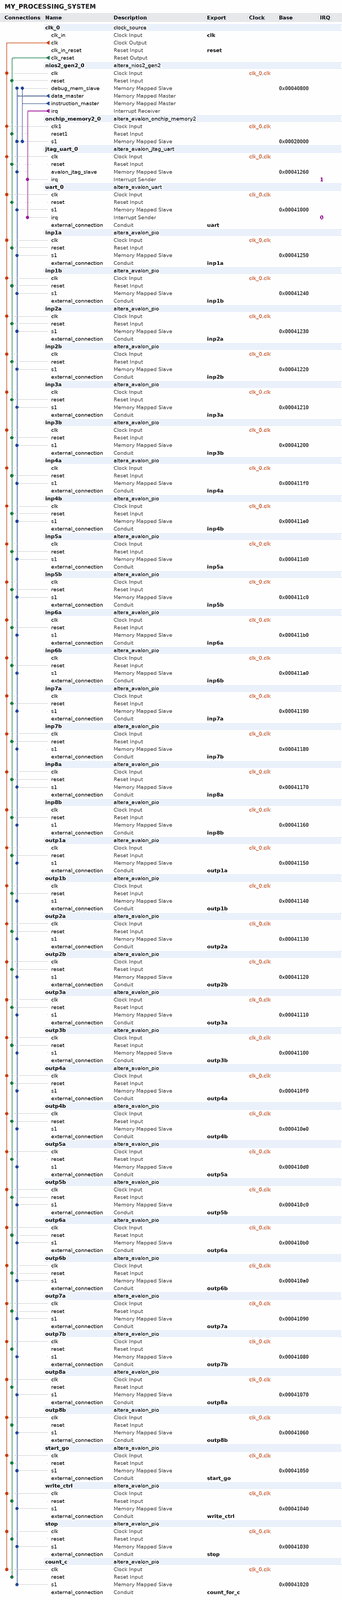
[diagram p0: system contents, whole]
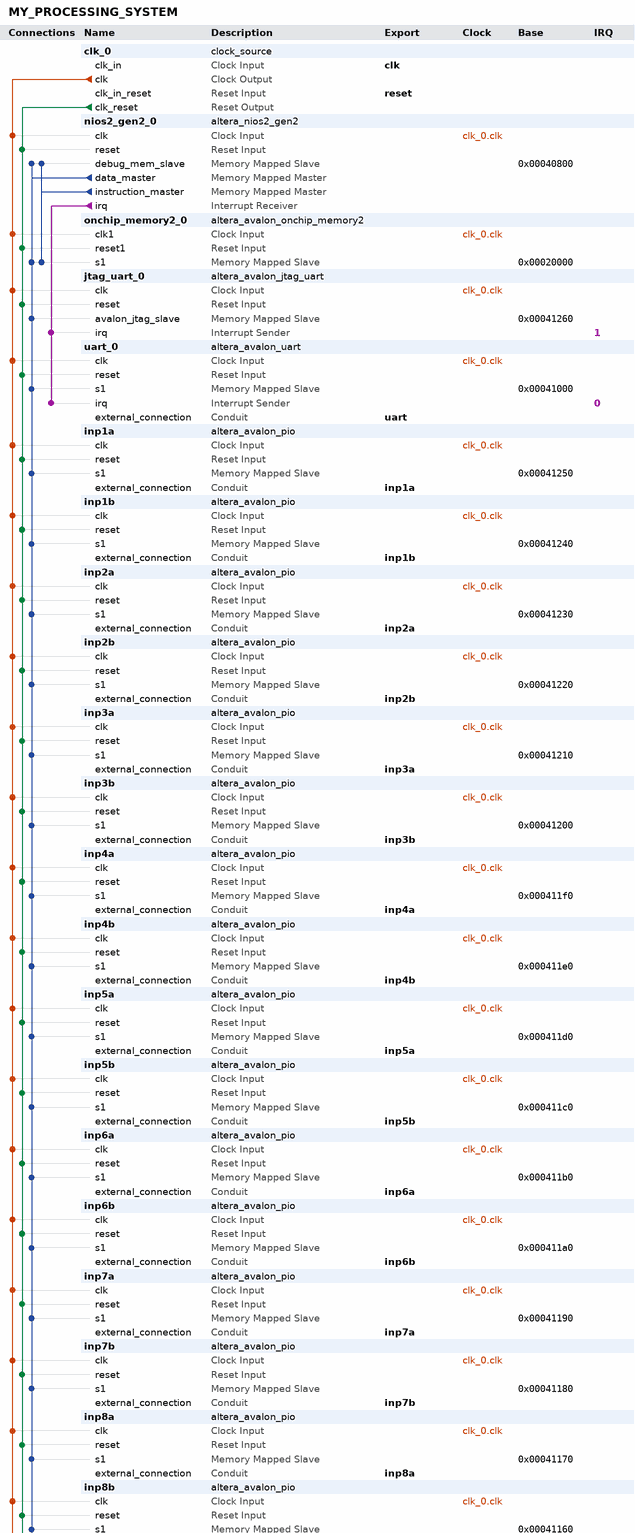
[diagram p1: system contents, upper part]
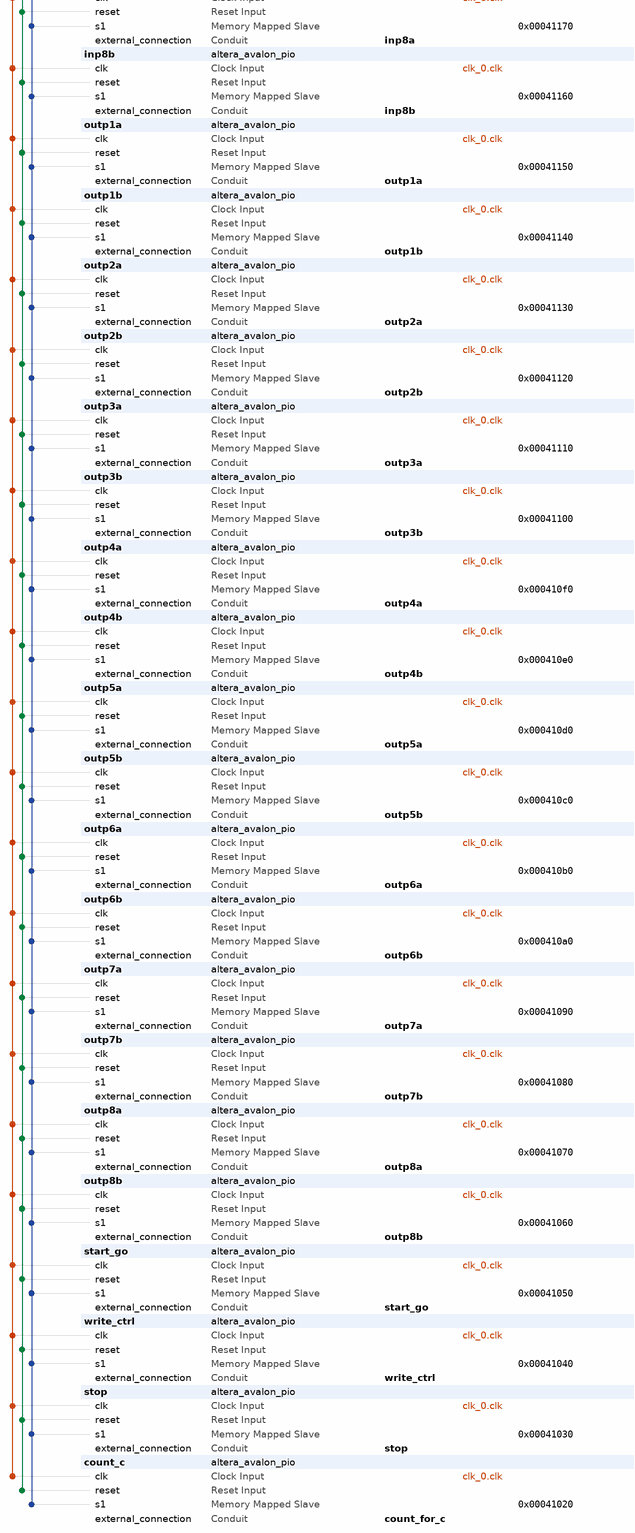
[diagram p2: system contents, lower part]
# Platform Designer (Qsys) system MY_PROCESSING_SYSTEM, Cyclone IV E EP4CE22F17C6
# Parameters at their usual value, and those the tool derives, are not listed.
package require -exact qsys 18.1
create_system MY_PROCESSING_SYSTEM
set_project_property DEVICE_FAMILY {Cyclone IV E}
set_project_property DEVICE EP4CE22F17C6

add_instance clk_0 clock_source 18.1
set_instance_parameter_value clk_0 clockFrequency 50000000

add_instance nios2_gen2_0 altera_nios2_gen2 18.1
set_instance_parameter_value nios2_gen2_0 dcache_size 2048
set_instance_parameter_value nios2_gen2_0 exceptionSlave onchip_memory2_0.s1
set_instance_parameter_value nios2_gen2_0 icache_size 4096
set_instance_parameter_value nios2_gen2_0 impl Tiny
set_instance_parameter_value nios2_gen2_0 resetSlave onchip_memory2_0.s1

add_instance onchip_memory2_0 altera_avalon_onchip_memory2 18.1
set_instance_parameter_value onchip_memory2_0 dataWidth 32
set_instance_parameter_value onchip_memory2_0 dualPort false
set_instance_parameter_value onchip_memory2_0 initMemContent true
set_instance_parameter_value onchip_memory2_0 initializationFileName D:/semester_2/wavelet_2d/software/wavelet_lab/mem_init/MY_PROCESSING_SYSTEM_onchip_memory2_0.hex
set_instance_parameter_value onchip_memory2_0 memorySize 20000
set_instance_parameter_value onchip_memory2_0 useNonDefaultInitFile true

add_instance jtag_uart_0 altera_avalon_jtag_uart 18.1
set_instance_parameter_value jtag_uart_0 simInteractiveOptions NO_INTERACTIVE_WINDOWS

add_instance uart_0 altera_avalon_uart 18.1
set_instance_parameter_value uart_0 baud 115200
set_instance_parameter_value uart_0 dataBits 8
set_instance_parameter_value uart_0 fixedBaud true
set_instance_parameter_value uart_0 parity NONE
set_instance_parameter_value uart_0 stopBits 1

add_instance inp1a altera_avalon_pio 18.1
set_instance_parameter_value inp1a direction Output
set_instance_parameter_value inp1a width 32

add_instance inp1b altera_avalon_pio 18.1
set_instance_parameter_value inp1b direction Output
set_instance_parameter_value inp1b width 32

add_instance inp2a altera_avalon_pio 18.1
set_instance_parameter_value inp2a direction Output
set_instance_parameter_value inp2a width 32

add_instance inp2b altera_avalon_pio 18.1
set_instance_parameter_value inp2b direction Output
set_instance_parameter_value inp2b width 32

add_instance inp3a altera_avalon_pio 18.1
set_instance_parameter_value inp3a direction Output
set_instance_parameter_value inp3a width 32

add_instance inp3b altera_avalon_pio 18.1
set_instance_parameter_value inp3b direction Output
set_instance_parameter_value inp3b width 32

add_instance inp4a altera_avalon_pio 18.1
set_instance_parameter_value inp4a direction Output
set_instance_parameter_value inp4a width 32

add_instance inp4b altera_avalon_pio 18.1
set_instance_parameter_value inp4b direction Output
set_instance_parameter_value inp4b width 32

add_instance inp5a altera_avalon_pio 18.1
set_instance_parameter_value inp5a direction Output
set_instance_parameter_value inp5a width 32

add_instance inp5b altera_avalon_pio 18.1
set_instance_parameter_value inp5b direction Output
set_instance_parameter_value inp5b width 32

add_instance inp6a altera_avalon_pio 18.1
set_instance_parameter_value inp6a direction Output
set_instance_parameter_value inp6a width 32

add_instance inp6b altera_avalon_pio 18.1
set_instance_parameter_value inp6b direction Output
set_instance_parameter_value inp6b width 32

add_instance inp7a altera_avalon_pio 18.1
set_instance_parameter_value inp7a direction Output
set_instance_parameter_value inp7a width 32

add_instance inp7b altera_avalon_pio 18.1
set_instance_parameter_value inp7b direction Output
set_instance_parameter_value inp7b width 32

add_instance inp8a altera_avalon_pio 18.1
set_instance_parameter_value inp8a direction Output
set_instance_parameter_value inp8a width 32

add_instance inp8b altera_avalon_pio 18.1
set_instance_parameter_value inp8b direction Output
set_instance_parameter_value inp8b width 32

add_instance outp1a altera_avalon_pio 18.1
set_instance_parameter_value outp1a direction Input
set_instance_parameter_value outp1a width 32

add_instance outp1b altera_avalon_pio 18.1
set_instance_parameter_value outp1b direction Input
set_instance_parameter_value outp1b width 32

add_instance outp2a altera_avalon_pio 18.1
set_instance_parameter_value outp2a direction Input
set_instance_parameter_value outp2a width 32

add_instance outp2b altera_avalon_pio 18.1
set_instance_parameter_value outp2b direction Input
set_instance_parameter_value outp2b width 32

add_instance outp3a altera_avalon_pio 18.1
set_instance_parameter_value outp3a direction Input
set_instance_parameter_value outp3a width 32

add_instance outp3b altera_avalon_pio 18.1
set_instance_parameter_value outp3b direction Input
set_instance_parameter_value outp3b width 32

add_instance outp4a altera_avalon_pio 18.1
set_instance_parameter_value outp4a direction Input
set_instance_parameter_value outp4a width 32

add_instance outp4b altera_avalon_pio 18.1
set_instance_parameter_value outp4b direction Input
set_instance_parameter_value outp4b width 32

add_instance outp5a altera_avalon_pio 18.1
set_instance_parameter_value outp5a direction Input
set_instance_parameter_value outp5a width 32

add_instance outp5b altera_avalon_pio 18.1
set_instance_parameter_value outp5b direction Input
set_instance_parameter_value outp5b width 32

add_instance outp6a altera_avalon_pio 18.1
set_instance_parameter_value outp6a direction Input
set_instance_parameter_value outp6a width 32

add_instance outp6b altera_avalon_pio 18.1
set_instance_parameter_value outp6b direction Input
set_instance_parameter_value outp6b width 32

add_instance outp7a altera_avalon_pio 18.1
set_instance_parameter_value outp7a direction Input
set_instance_parameter_value outp7a width 32

add_instance outp7b altera_avalon_pio 18.1
set_instance_parameter_value outp7b direction Input
set_instance_parameter_value outp7b width 32

add_instance outp8a altera_avalon_pio 18.1
set_instance_parameter_value outp8a direction Input
set_instance_parameter_value outp8a width 32

add_instance outp8b altera_avalon_pio 18.1
set_instance_parameter_value outp8b direction Input
set_instance_parameter_value outp8b width 32

add_instance start_go altera_avalon_pio 18.1
set_instance_parameter_value start_go direction Output
set_instance_parameter_value start_go width 32

add_instance write_ctrl altera_avalon_pio 18.1
set_instance_parameter_value write_ctrl direction Input
set_instance_parameter_value write_ctrl width 32

add_instance stop altera_avalon_pio 18.1
set_instance_parameter_value stop direction Input
set_instance_parameter_value stop width 32

add_instance count_c altera_avalon_pio 18.1
set_instance_parameter_value count_c direction Input
set_instance_parameter_value count_c width 32

# connections
add_connection clk_0.clk count_c.clk clock
add_connection clk_0.clk inp1a.clk clock
add_connection clk_0.clk inp1b.clk clock
add_connection clk_0.clk inp2a.clk clock
add_connection clk_0.clk inp2b.clk clock
add_connection clk_0.clk inp3a.clk clock
add_connection clk_0.clk inp3b.clk clock
add_connection clk_0.clk inp4a.clk clock
add_connection clk_0.clk inp4b.clk clock
add_connection clk_0.clk inp5a.clk clock
add_connection clk_0.clk inp5b.clk clock
add_connection clk_0.clk inp6a.clk clock
add_connection clk_0.clk inp6b.clk clock
add_connection clk_0.clk inp7a.clk clock
add_connection clk_0.clk inp7b.clk clock
add_connection clk_0.clk inp8a.clk clock
add_connection clk_0.clk inp8b.clk clock
add_connection clk_0.clk jtag_uart_0.clk clock
add_connection clk_0.clk nios2_gen2_0.clk clock
add_connection clk_0.clk onchip_memory2_0.clk1 clock
add_connection clk_0.clk outp1a.clk clock
add_connection clk_0.clk outp1b.clk clock
add_connection clk_0.clk outp2a.clk clock
add_connection clk_0.clk outp2b.clk clock
add_connection clk_0.clk outp3a.clk clock
add_connection clk_0.clk outp3b.clk clock
add_connection clk_0.clk outp4a.clk clock
add_connection clk_0.clk outp4b.clk clock
add_connection clk_0.clk outp5a.clk clock
add_connection clk_0.clk outp5b.clk clock
add_connection clk_0.clk outp6a.clk clock
add_connection clk_0.clk outp6b.clk clock
add_connection clk_0.clk outp7a.clk clock
add_connection clk_0.clk outp7b.clk clock
add_connection clk_0.clk outp8a.clk clock
add_connection clk_0.clk outp8b.clk clock
add_connection clk_0.clk start_go.clk clock
add_connection clk_0.clk stop.clk clock
add_connection clk_0.clk uart_0.clk clock
add_connection clk_0.clk write_ctrl.clk clock
add_connection clk_0.clk_reset count_c.reset reset
add_connection clk_0.clk_reset inp1a.reset reset
add_connection clk_0.clk_reset inp1b.reset reset
add_connection clk_0.clk_reset inp2a.reset reset
add_connection clk_0.clk_reset inp2b.reset reset
add_connection clk_0.clk_reset inp3a.reset reset
add_connection clk_0.clk_reset inp3b.reset reset
add_connection clk_0.clk_reset inp4a.reset reset
add_connection clk_0.clk_reset inp4b.reset reset
add_connection clk_0.clk_reset inp5a.reset reset
add_connection clk_0.clk_reset inp5b.reset reset
add_connection clk_0.clk_reset inp6a.reset reset
add_connection clk_0.clk_reset inp6b.reset reset
add_connection clk_0.clk_reset inp7a.reset reset
add_connection clk_0.clk_reset inp7b.reset reset
add_connection clk_0.clk_reset inp8a.reset reset
add_connection clk_0.clk_reset inp8b.reset reset
add_connection clk_0.clk_reset jtag_uart_0.reset reset
add_connection clk_0.clk_reset nios2_gen2_0.reset reset
add_connection clk_0.clk_reset onchip_memory2_0.reset1 reset
add_connection clk_0.clk_reset outp1a.reset reset
add_connection clk_0.clk_reset outp1b.reset reset
add_connection clk_0.clk_reset outp2a.reset reset
add_connection clk_0.clk_reset outp2b.reset reset
add_connection clk_0.clk_reset outp3a.reset reset
add_connection clk_0.clk_reset outp3b.reset reset
add_connection clk_0.clk_reset outp4a.reset reset
add_connection clk_0.clk_reset outp4b.reset reset
add_connection clk_0.clk_reset outp5a.reset reset
add_connection clk_0.clk_reset outp5b.reset reset
add_connection clk_0.clk_reset outp6a.reset reset
add_connection clk_0.clk_reset outp6b.reset reset
add_connection clk_0.clk_reset outp7a.reset reset
add_connection clk_0.clk_reset outp7b.reset reset
add_connection clk_0.clk_reset outp8a.reset reset
add_connection clk_0.clk_reset outp8b.reset reset
add_connection clk_0.clk_reset start_go.reset reset
add_connection clk_0.clk_reset stop.reset reset
add_connection clk_0.clk_reset uart_0.reset reset
add_connection clk_0.clk_reset write_ctrl.reset reset
add_connection nios2_gen2_0.data_master count_c.s1 avalon
set_connection_parameter_value nios2_gen2_0.data_master/count_c.s1 baseAddress 0x00041020
add_connection nios2_gen2_0.data_master inp1a.s1 avalon
set_connection_parameter_value nios2_gen2_0.data_master/inp1a.s1 baseAddress 0x00041250
add_connection nios2_gen2_0.data_master inp1b.s1 avalon
set_connection_parameter_value nios2_gen2_0.data_master/inp1b.s1 baseAddress 0x00041240
add_connection nios2_gen2_0.data_master inp2a.s1 avalon
set_connection_parameter_value nios2_gen2_0.data_master/inp2a.s1 baseAddress 0x00041230
add_connection nios2_gen2_0.data_master inp2b.s1 avalon
set_connection_parameter_value nios2_gen2_0.data_master/inp2b.s1 baseAddress 0x00041220
add_connection nios2_gen2_0.data_master inp3a.s1 avalon
set_connection_parameter_value nios2_gen2_0.data_master/inp3a.s1 baseAddress 0x00041210
add_connection nios2_gen2_0.data_master inp3b.s1 avalon
set_connection_parameter_value nios2_gen2_0.data_master/inp3b.s1 baseAddress 0x00041200
add_connection nios2_gen2_0.data_master inp4a.s1 avalon
set_connection_parameter_value nios2_gen2_0.data_master/inp4a.s1 baseAddress 0x000411f0
add_connection nios2_gen2_0.data_master inp4b.s1 avalon
set_connection_parameter_value nios2_gen2_0.data_master/inp4b.s1 baseAddress 0x000411e0
add_connection nios2_gen2_0.data_master inp5a.s1 avalon
set_connection_parameter_value nios2_gen2_0.data_master/inp5a.s1 baseAddress 0x000411d0
add_connection nios2_gen2_0.data_master inp5b.s1 avalon
set_connection_parameter_value nios2_gen2_0.data_master/inp5b.s1 baseAddress 0x000411c0
add_connection nios2_gen2_0.data_master inp6a.s1 avalon
set_connection_parameter_value nios2_gen2_0.data_master/inp6a.s1 baseAddress 0x000411b0
add_connection nios2_gen2_0.data_master inp6b.s1 avalon
set_connection_parameter_value nios2_gen2_0.data_master/inp6b.s1 baseAddress 0x000411a0
add_connection nios2_gen2_0.data_master inp7a.s1 avalon
set_connection_parameter_value nios2_gen2_0.data_master/inp7a.s1 baseAddress 0x00041190
add_connection nios2_gen2_0.data_master inp7b.s1 avalon
set_connection_parameter_value nios2_gen2_0.data_master/inp7b.s1 baseAddress 0x00041180
add_connection nios2_gen2_0.data_master inp8a.s1 avalon
set_connection_parameter_value nios2_gen2_0.data_master/inp8a.s1 baseAddress 0x00041170
add_connection nios2_gen2_0.data_master inp8b.s1 avalon
set_connection_parameter_value nios2_gen2_0.data_master/inp8b.s1 baseAddress 0x00041160
add_connection nios2_gen2_0.data_master jtag_uart_0.avalon_jtag_slave avalon
set_connection_parameter_value nios2_gen2_0.data_master/jtag_uart_0.avalon_jtag_slave baseAddress 0x00041260
add_connection nios2_gen2_0.data_master nios2_gen2_0.debug_mem_slave avalon
set_connection_parameter_value nios2_gen2_0.data_master/nios2_gen2_0.debug_mem_slave baseAddress 0x00040800
add_connection nios2_gen2_0.data_master onchip_memory2_0.s1 avalon
set_connection_parameter_value nios2_gen2_0.data_master/onchip_memory2_0.s1 baseAddress 0x00020000
add_connection nios2_gen2_0.data_master outp1a.s1 avalon
set_connection_parameter_value nios2_gen2_0.data_master/outp1a.s1 baseAddress 0x00041150
add_connection nios2_gen2_0.data_master outp1b.s1 avalon
set_connection_parameter_value nios2_gen2_0.data_master/outp1b.s1 baseAddress 0x00041140
add_connection nios2_gen2_0.data_master outp2a.s1 avalon
set_connection_parameter_value nios2_gen2_0.data_master/outp2a.s1 baseAddress 0x00041130
add_connection nios2_gen2_0.data_master outp2b.s1 avalon
set_connection_parameter_value nios2_gen2_0.data_master/outp2b.s1 baseAddress 0x00041120
add_connection nios2_gen2_0.data_master outp3a.s1 avalon
set_connection_parameter_value nios2_gen2_0.data_master/outp3a.s1 baseAddress 0x00041110
add_connection nios2_gen2_0.data_master outp3b.s1 avalon
set_connection_parameter_value nios2_gen2_0.data_master/outp3b.s1 baseAddress 0x00041100
add_connection nios2_gen2_0.data_master outp4a.s1 avalon
set_connection_parameter_value nios2_gen2_0.data_master/outp4a.s1 baseAddress 0x000410f0
add_connection nios2_gen2_0.data_master outp4b.s1 avalon
set_connection_parameter_value nios2_gen2_0.data_master/outp4b.s1 baseAddress 0x000410e0
add_connection nios2_gen2_0.data_master outp5a.s1 avalon
set_connection_parameter_value nios2_gen2_0.data_master/outp5a.s1 baseAddress 0x000410d0
add_connection nios2_gen2_0.data_master outp5b.s1 avalon
set_connection_parameter_value nios2_gen2_0.data_master/outp5b.s1 baseAddress 0x000410c0
add_connection nios2_gen2_0.data_master outp6a.s1 avalon
set_connection_parameter_value nios2_gen2_0.data_master/outp6a.s1 baseAddress 0x000410b0
add_connection nios2_gen2_0.data_master outp6b.s1 avalon
set_connection_parameter_value nios2_gen2_0.data_master/outp6b.s1 baseAddress 0x000410a0
add_connection nios2_gen2_0.data_master outp7a.s1 avalon
set_connection_parameter_value nios2_gen2_0.data_master/outp7a.s1 baseAddress 0x00041090
add_connection nios2_gen2_0.data_master outp7b.s1 avalon
set_connection_parameter_value nios2_gen2_0.data_master/outp7b.s1 baseAddress 0x00041080
add_connection nios2_gen2_0.data_master outp8a.s1 avalon
set_connection_parameter_value nios2_gen2_0.data_master/outp8a.s1 baseAddress 0x00041070
add_connection nios2_gen2_0.data_master outp8b.s1 avalon
set_connection_parameter_value nios2_gen2_0.data_master/outp8b.s1 baseAddress 0x00041060
add_connection nios2_gen2_0.data_master start_go.s1 avalon
set_connection_parameter_value nios2_gen2_0.data_master/start_go.s1 baseAddress 0x00041050
add_connection nios2_gen2_0.data_master stop.s1 avalon
set_connection_parameter_value nios2_gen2_0.data_master/stop.s1 baseAddress 0x00041030
add_connection nios2_gen2_0.data_master uart_0.s1 avalon
set_connection_parameter_value nios2_gen2_0.data_master/uart_0.s1 baseAddress 0x00041000
add_connection nios2_gen2_0.data_master write_ctrl.s1 avalon
set_connection_parameter_value nios2_gen2_0.data_master/write_ctrl.s1 baseAddress 0x00041040
add_connection nios2_gen2_0.instruction_master nios2_gen2_0.debug_mem_slave avalon
set_connection_parameter_value nios2_gen2_0.instruction_master/nios2_gen2_0.debug_mem_slave baseAddress 0x00040800
add_connection nios2_gen2_0.instruction_master onchip_memory2_0.s1 avalon
set_connection_parameter_value nios2_gen2_0.instruction_master/onchip_memory2_0.s1 baseAddress 0x00020000
add_connection nios2_gen2_0.irq jtag_uart_0.irq interrupt
set_connection_parameter_value nios2_gen2_0.irq/jtag_uart_0.irq irqNumber 1
add_connection nios2_gen2_0.irq uart_0.irq interrupt
set_connection_parameter_value nios2_gen2_0.irq/uart_0.irq irqNumber 0

# exported interfaces
add_interface clk clock sink
set_interface_property clk EXPORT_OF clk_0.clk_in
add_interface count_for_c conduit end
set_interface_property count_for_c EXPORT_OF count_c.external_connection
add_interface inp1a conduit end
set_interface_property inp1a EXPORT_OF inp1a.external_connection
add_interface inp1b conduit end
set_interface_property inp1b EXPORT_OF inp1b.external_connection
add_interface inp2a conduit end
set_interface_property inp2a EXPORT_OF inp2a.external_connection
add_interface inp2b conduit end
set_interface_property inp2b EXPORT_OF inp2b.external_connection
add_interface inp3a conduit end
set_interface_property inp3a EXPORT_OF inp3a.external_connection
add_interface inp3b conduit end
set_interface_property inp3b EXPORT_OF inp3b.external_connection
add_interface inp4a conduit end
set_interface_property inp4a EXPORT_OF inp4a.external_connection
add_interface inp4b conduit end
set_interface_property inp4b EXPORT_OF inp4b.external_connection
add_interface inp5a conduit end
set_interface_property inp5a EXPORT_OF inp5a.external_connection
add_interface inp5b conduit end
set_interface_property inp5b EXPORT_OF inp5b.external_connection
add_interface inp6a conduit end
set_interface_property inp6a EXPORT_OF inp6a.external_connection
add_interface inp6b conduit end
set_interface_property inp6b EXPORT_OF inp6b.external_connection
add_interface inp7a conduit end
set_interface_property inp7a EXPORT_OF inp7a.external_connection
add_interface inp7b conduit end
set_interface_property inp7b EXPORT_OF inp7b.external_connection
add_interface inp8a conduit end
set_interface_property inp8a EXPORT_OF inp8a.external_connection
add_interface inp8b conduit end
set_interface_property inp8b EXPORT_OF inp8b.external_connection
add_interface outp1a conduit end
set_interface_property outp1a EXPORT_OF outp1a.external_connection
add_interface outp1b conduit end
set_interface_property outp1b EXPORT_OF outp1b.external_connection
add_interface outp2a conduit end
set_interface_property outp2a EXPORT_OF outp2a.external_connection
add_interface outp2b conduit end
set_interface_property outp2b EXPORT_OF outp2b.external_connection
add_interface outp3a conduit end
set_interface_property outp3a EXPORT_OF outp3a.external_connection
add_interface outp3b conduit end
set_interface_property outp3b EXPORT_OF outp3b.external_connection
add_interface outp4a conduit end
set_interface_property outp4a EXPORT_OF outp4a.external_connection
add_interface outp4b conduit end
set_interface_property outp4b EXPORT_OF outp4b.external_connection
add_interface outp5a conduit end
set_interface_property outp5a EXPORT_OF outp5a.external_connection
add_interface outp5b conduit end
set_interface_property outp5b EXPORT_OF outp5b.external_connection
add_interface outp6a conduit end
set_interface_property outp6a EXPORT_OF outp6a.external_connection
add_interface outp6b conduit end
set_interface_property outp6b EXPORT_OF outp6b.external_connection
add_interface outp7a conduit end
set_interface_property outp7a EXPORT_OF outp7a.external_connection
add_interface outp7b conduit end
set_interface_property outp7b EXPORT_OF outp7b.external_connection
add_interface outp8a conduit end
set_interface_property outp8a EXPORT_OF outp8a.external_connection
add_interface outp8b conduit end
set_interface_property outp8b EXPORT_OF outp8b.external_connection
add_interface reset reset sink
set_interface_property reset EXPORT_OF clk_0.clk_in_reset
add_interface start_go conduit end
set_interface_property start_go EXPORT_OF start_go.external_connection
add_interface stop conduit end
set_interface_property stop EXPORT_OF stop.external_connection
add_interface uart conduit end
set_interface_property uart EXPORT_OF uart_0.external_connection
add_interface write_ctrl conduit end
set_interface_property write_ctrl EXPORT_OF write_ctrl.external_connection

set_interconnect_requirement {$system} qsys_mm.clockCrossingAdapter HANDSHAKE
set_interconnect_requirement {$system} qsys_mm.enableEccProtection FALSE
set_interconnect_requirement {$system} qsys_mm.insertDefaultSlave FALSE
set_interconnect_requirement {$system} qsys_mm.maxAdditionalLatency 1

save_system MY_PROCESSING_SYSTEM.qsys
